# EAGLE design Motor Controller removable maintenance adapter board (EAGLE 7.7.0)
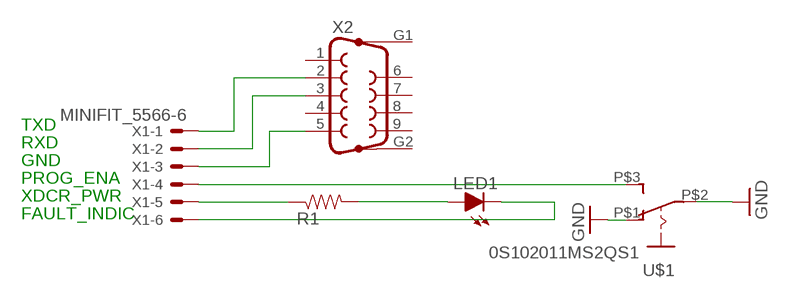
[diagram p0: schematic, sheet 1]

## Parts
LED1  LED-0805  [LED-805]
R1  RESISTOR0805-RES  [0805]
U$1  0S102011MS2QS1  [0S102011MS2QS1]
X1  MINIFIT_5566-6  [MINIFIT_5566-6]
X2  F09HP  [F09HP]

## Nets
GND: U$1.P$1(O) U$1.P$2(P)
N$1: LED1.A R1.2
N$2: R1.1 X1.5
N$3: LED1.C X1.6
N$4: U$1.P$3(S) X1.4
N$6: X1.1 X2.2
N$7: X1.2 X2.3
N$8: X1.3 X2.5
Unconnected: X2.1 X2.4 X2.6 X2.7 X2.8 X2.9 X2.G1 X2.G2

## Notes on the sheet
- TXD
- RXD
- GND
- PROG_ENA
- XDCR_PWR
- FAULT_INDIC

## Library data of the parts
LED1 = HyTechDevices:LED: Light Emitting Diode (LED) Source: Dangerous Prototypes Eagle Library <https://github.com/DangerousPrototypes/Eagle_Part_Library>
R1 = HyTechDevices:RESISTOR: Resistor Basic schematic elements and footprints for 0603, 1206, and PTH resistors.
U$1 = HyTechDevices:0S102011MS2QS1: Slide Switch 0S102011MS2QS1
X1 = HyTechDevices:MINIFIT_5566-6: Mini-Fit Junior connector 6 pole Source: http://www.molex.com; MPN: 95566-61002; OC_FARNELL: unknown; OC_NEWARK: 22K8620
X2 = con-subd:F09HP: SUB-D; OC_FARNELL: unknown; OC_NEWARK: unknown

## Board
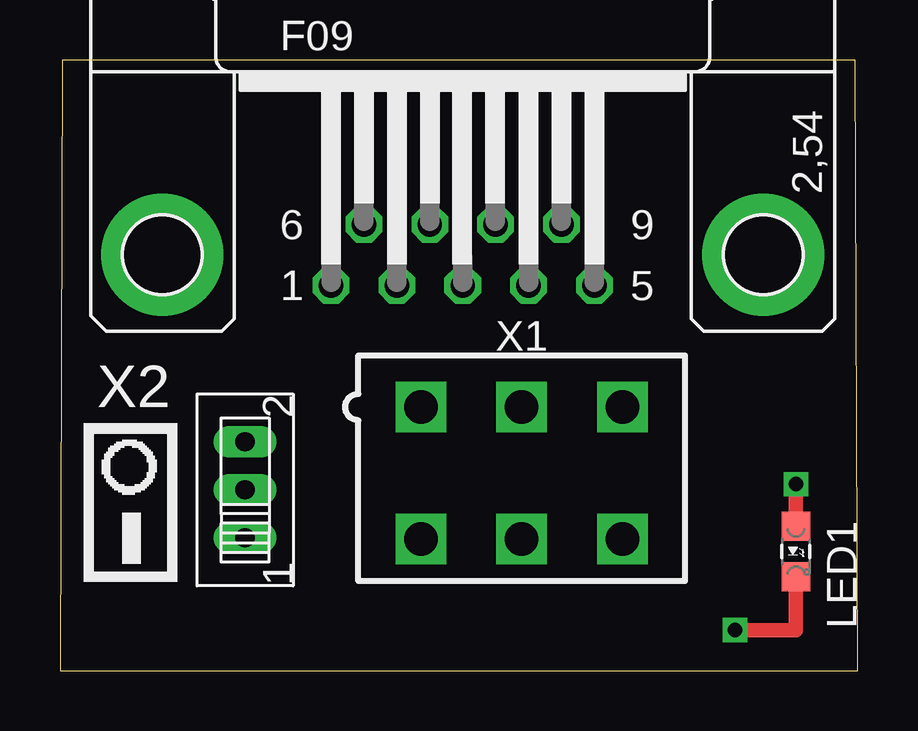
[diagram p1: board, top side]
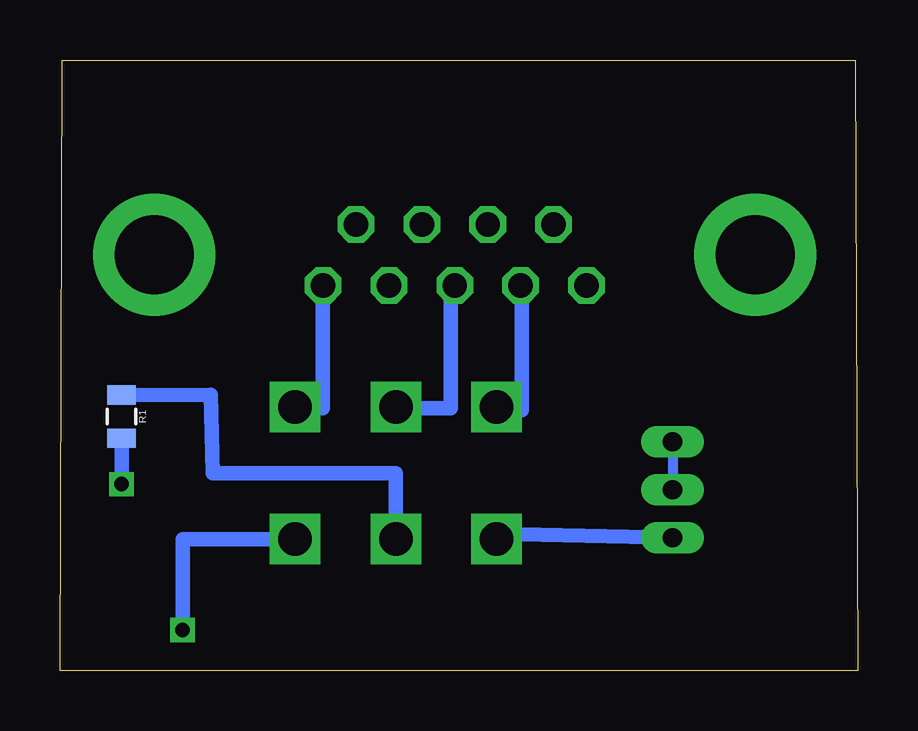
[diagram p2: board, bottom side, seen from below]

Size 33.23 x 25.44 mm. Coordinates in mm from the lower left corner, seen from the top.
Outline: 0,0 33.23,0 33.15,25.44 0.09,25.44 0,0
Copper layers (1*16): Top 0.035mm / dielectric 1.5mm / Bottom 0.035mm
Design rules "default": minimum track width 10mil, minimum drill 24mil, track to track 8mil, track to pad 8mil, pad to pad 8mil, via to via 8mil, smd to smd 8mil, copper to edge 40mil, drill to drill 8mil, minimum pad ring 10mil, minimum via ring 8mil, stop-mask expansion 4mil, vias tented up to drill 0mil, thermal gap 10mil

### Footprints (pad centres in the part's own frame; a part is rotated, then mirrored left to right if it is on the bottom)
LED-805 = smd 1.2 x 1.2: A 0,-1.05; C 0,1.05
0805 = smd 0.8 x 1.2: 1 -0.9,0; 2 0.9,0
0S102011MS2QS1 = drill 0.8 long: P$1 0,0; P$2 2,0; P$3 -2,0
MINIFIT_5566-6 = drill 1.4 square: 1 4.2,-2.75; 2 0,-2.75; 3 -4.2,-2.75; 4 4.2,2.75; 5 0,2.75; 6 -4.2,2.75
F09HP = drill 1.016 octagon: 1 -5.486,-1.27; 2 -2.743,-1.27; 3 0,-1.27; 4 2.743,-1.27; 5 5.486,-1.27; 6 -4.115,1.27; 7 -1.372,1.27; 8 1.372,1.27; 9 4.115,1.27 | drill 3.302 pad 5.08: G1 -12.522,0; G2 12.522,0

### Placement (x,y rotation side)
LED1  30.67,4.96 180 top
R1  30.67,10.58 270 bottom
U$1  7.71,7.53 90 top
X1  19.24,8.23 180 top
X2  16.78,17.32 0 top

### Tracks (layer width: path | path; a pad name or v marks a point on that pad's centre or on a via)
GND
  Bottom 0.406: U$1.P$2 U$1.P$1
N$1  (via drill 0.6)
  Top 0.61: LED1.A v30.67,7.77
  Bottom 0.61: v30.67,7.77 R1.2
N$2
  Bottom 0.61: R1.1 26.94,11.48 26.86,8.23 19.24,8.23 X1.5
N$3  (via drill 0.6)
  Top 0.61: v28.13,1.69 30.67,1.69 LED1.C
  Bottom 0.61: X1.6 28.13,5.48 v28.13,1.69
N$4
  Bottom 0.61: U$1.P$3 15.04,5.7 X1.4
N$6
  Bottom 0.61: X2.2 13.98,16.05 13.98,10.85 15.04,10.85 X1.1
N$7
  Bottom 0.61: X2.3 16.95,16.05 16.95,10.93 19.24,10.93 X1.2
N$8
  Bottom 0.61: X2.5 22.28,10.93 23.44,10.93 X1.3